# Altium schematic sheet Wenzel_REF.schdoc: =SheetTitle_Top
size 420 x 297 mm; EDA_Number: ARTIQ; Author: G.Kasprowicz; CompanyName: WUT ISE; DrawnBy: G.Kasprowicz; Organization: WUT ISE; Address1: PW ISE; Address2: Nowowiejska 15/19 00-665 Warsaw; Address3: gkasprow@gmail.com; ModifiedBy: -; CheckedDate: -; Title2: Top; DivGrp: WUT ISE; Designer: G.Kasprowicz; ModifiedDate: -; ProjectName: Sensor Box
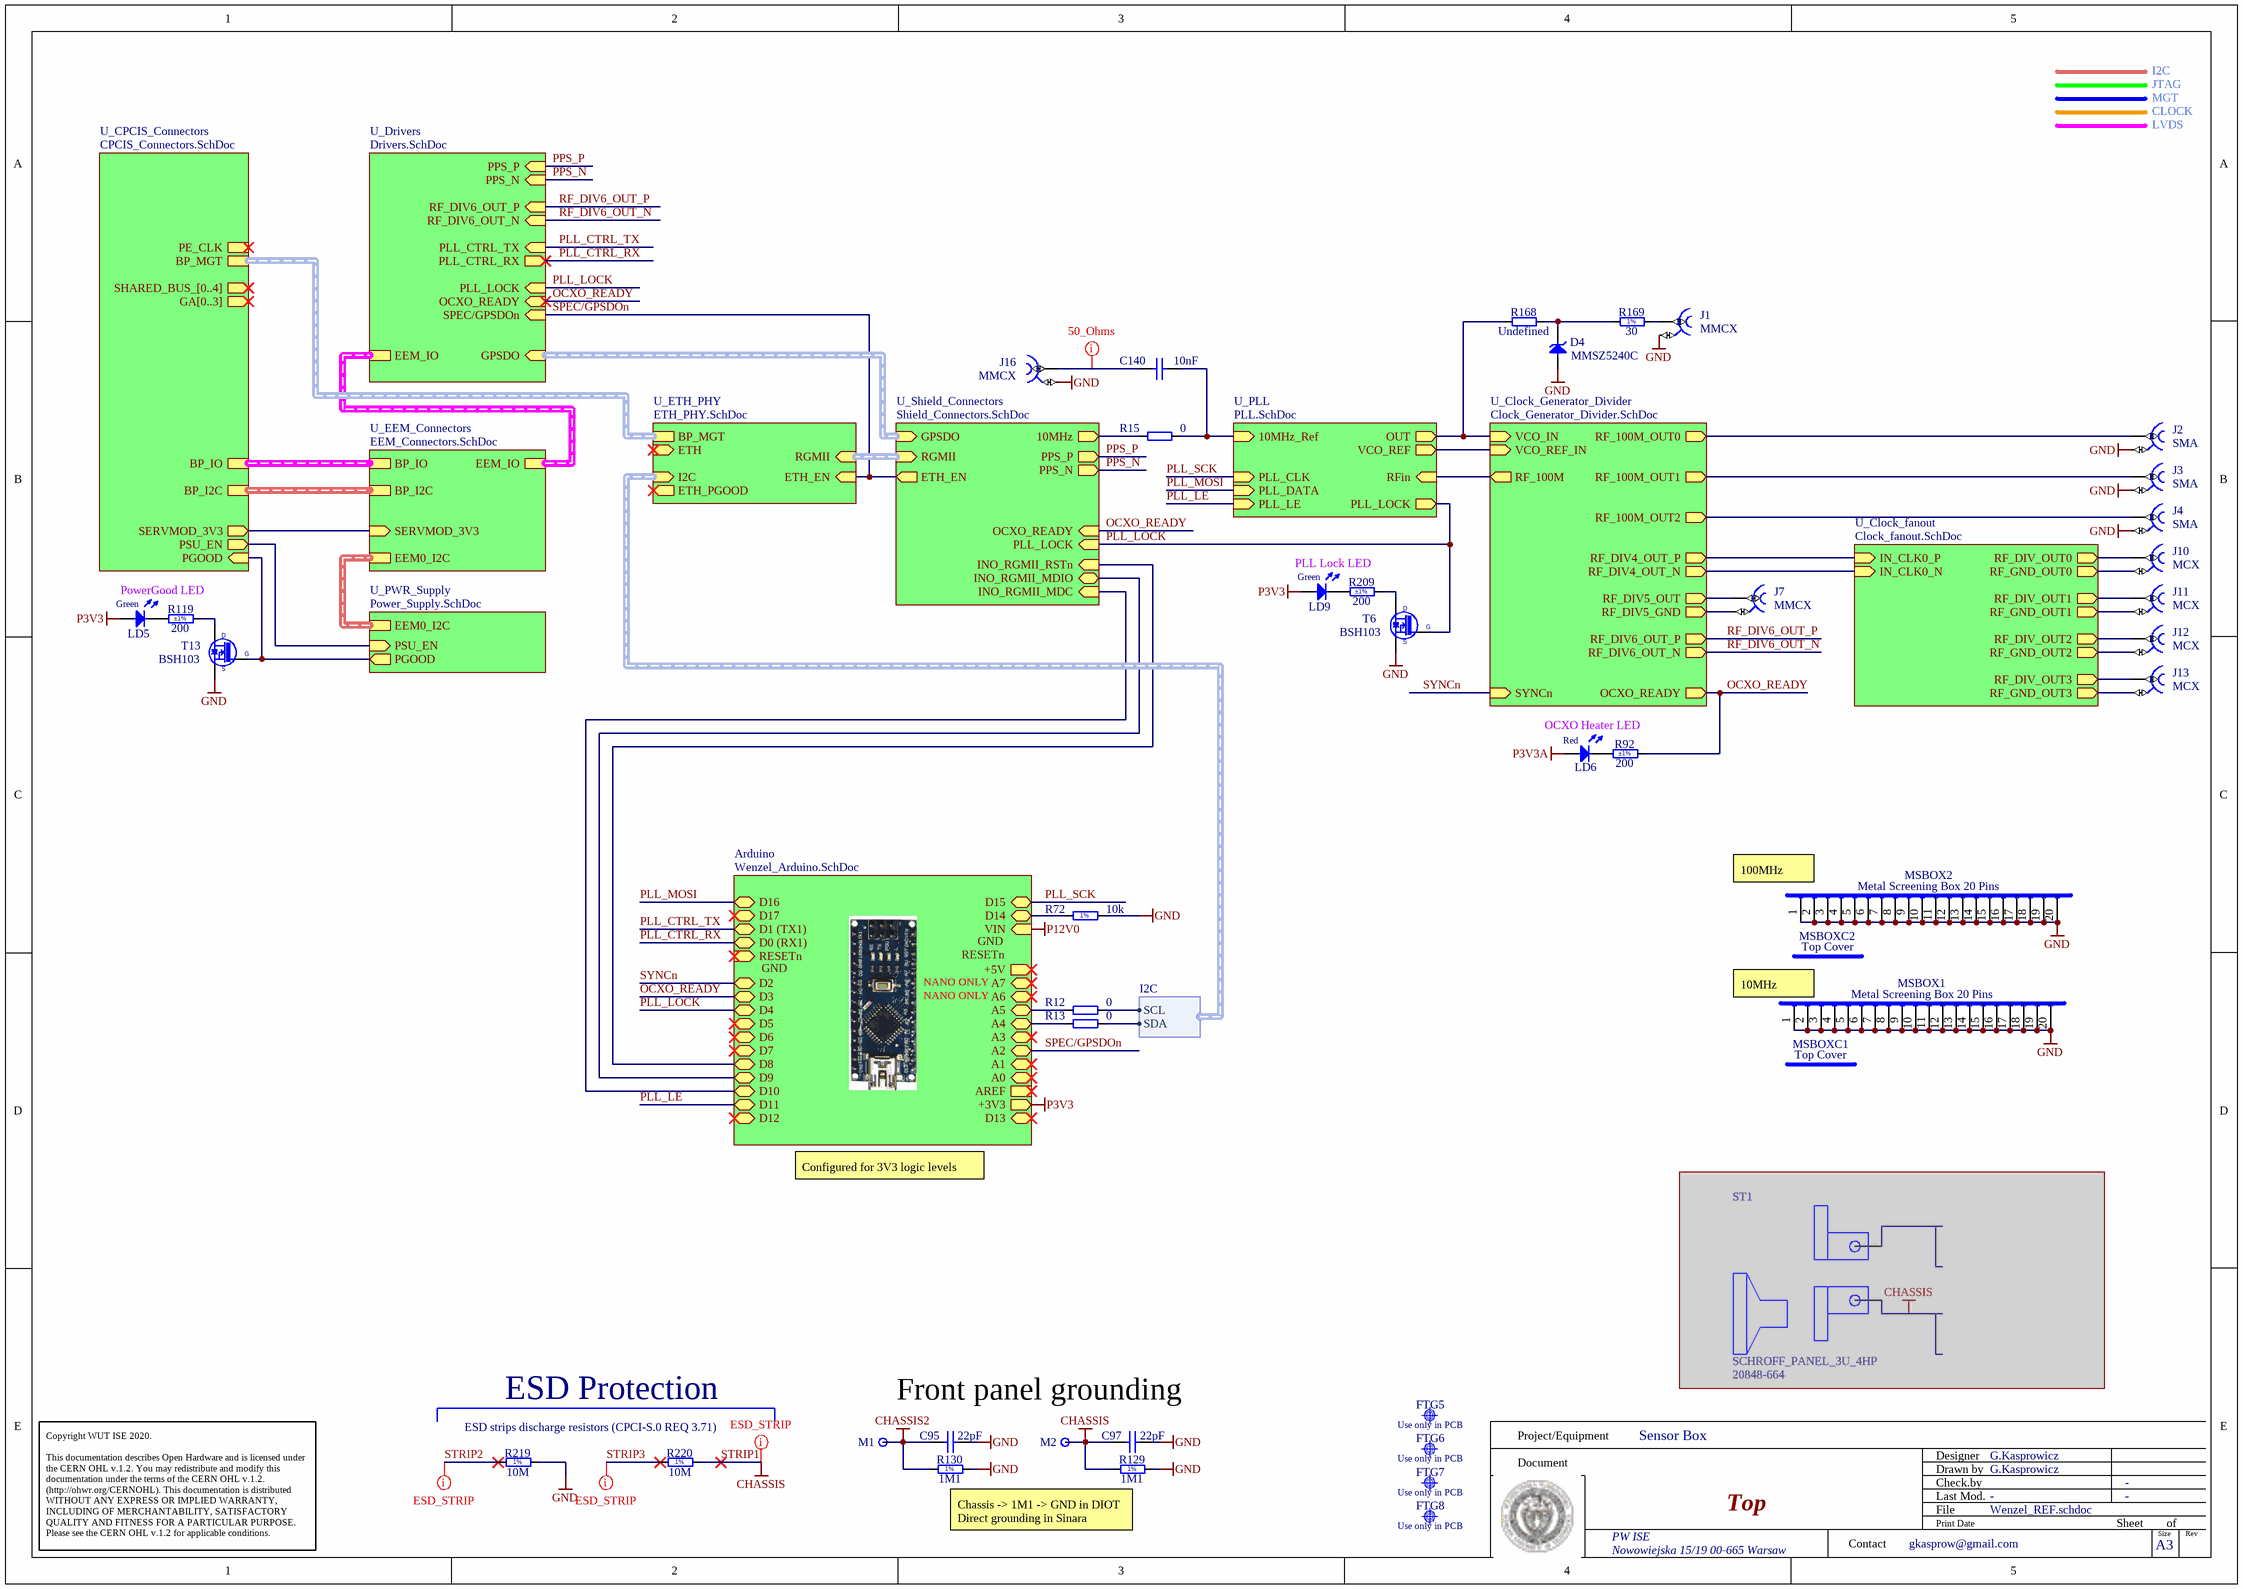
[diagram p0: Wenzel_REF.schdoc]

## Parts
C95  22pF  [CAPC1005X55N]
C97  22pF  [CAPC1005X55N]
C140  10nF  [CAPC1005X55N]
D4  MMSZ5240C  [SOD3716X135N]
FTG5  Use only in PCB  [FIDUCIAL_TOP_C100-200]  (no BOM)
FTG6  Use only in PCB  [FIDUCIAL_TOP_S100-200]  (no BOM)
FTG7  Use only in PCB  [FIDUCIAL_TOP_S100-200]  (no BOM)
FTG8  Use only in PCB  [FIDUCIAL_TOP_S100-200]  (no BOM)
J1  MMCX  [SAMTEC_MMCX-J-P-H-ST-TH1]
J2  SMA  [MOLEX_73251-2120]
J3  SMA  [MOLEX_73251-2120]
J4  SMA  [MOLEX_73251-2120]
J7  MMCX  [SAMTEC_MMCX-J-P-H-ST-TH1]
J10  MCX  [AMPHENOL_919-383J-51A]
J11  MCX  [AMPHENOL_919-383J-51A]
J12  MCX  [AMPHENOL_919-383J-51A]
J13  MCX  [AMPHENOL_919-383J-51A]
J16  MMCX  [SAMTEC_MMCX-J-P-H-ST-TH1]
LD5  Green  [LED_DIALIGHT_555-230]
LD6  Red  [LED_DIALIGHT_555-200]
LD9  Green  [LED_DIALIGHT_555-230]
M1  Plated Hole  [MTG300_600]  (value not drawn)  (no BOM)
M2  Plated Hole  [MTG300_600]  (value not drawn)  (no BOM)
MSBOX1  Metal Screening Box 20 Pins  [MSBOX_LAIRD_BMI-S-204-F]
MSBOX2  Metal Screening Box 20 Pins  [MSBOX_LAIRD_BMI-S-204-F]
MSBOXC1  Top Cover  [MSBOX_LAIRD_BMI-S-204-C]
MSBOXC2  Top Cover  [MSBOX_LAIRD_BMI-S-204-C]
R12  0  [RESC1005X40N]
R13  0  [RESC1005X40N]
R15  0  [RESC1005X40N]
R72  10k  [RESC1005X40N]
R92  200  Tolerance: ±1%  [RESC1005X40N]
R119  200  Tolerance: ±1%  [RESC1005X40N]
R129  1M1  [RESC2012X60N]
R130  1M1  [RESC2012X60N]
R168  Undefined  [RESC1608X55N]
R169  30  [RESC1608X55N]
R209  200  Tolerance: ±1%  [RESC1005X40N]
R219  10M  [RESC2113X55N]
R220  10M  [RESC2113X55N]
ST1  SCHROFF_PANEL_3U_4HP  Manufacturer Part Number 2: 20848-664  [SCHROFF_PANEL_3HP_4U]  (masked out: inside a compile mask, not in the netlist)
T6  BSH103  [SOT95P230X110-3N]
T13  BSH103  [SOT95P230X110-3N]

## Sub-sheets
Arduino = Wenzel_Arduino.SchDoc: D16 (bidir), D2 (bidir), D3 (bidir), D1 (TX1) (bidir), D17 (bidir), D7 (bidir), D8 (bidir), D9 (bidir), D14 (bidir), D11 (bidir), D0 (RX1) (bidir), D10 (bidir), D6 (bidir), D15 (bidir), D4 (bidir), D5 (bidir), D12 (bidir), A7 (bidir), D13 (bidir), +3V3 (out), +5V (out), AREF, A1 (bidir), A3 (bidir), A4 (bidir), A2 (bidir), VIN (in), RESETn (in), A6 (bidir), A5 (bidir), A0 (bidir)
U_Clock_fanout = Clock_fanout.SchDoc: IN_CLK0_P (in), IN_CLK0_N (in), RF_DIV_OUT0 (out), RF_GND_OUT0 (out), RF_DIV_OUT1 (out), RF_DIV_OUT2 (out), RF_DIV_OUT3 (out), RF_GND_OUT1 (out), RF_GND_OUT2 (out), RF_GND_OUT3 (out)
U_Clock_Generator_Divider = Clock_Generator_Divider.SchDoc: RF_100M_OUT0 (out), RF_100M_OUT1 (out), RF_100M_OUT2 (out), SYNCn (in), VCO_IN (in), VCO_REF_IN (in), OCXO_READY (out), RF_DIV4_OUT_P (out), RF_DIV4_OUT_N (out), RF_DIV5_OUT (out), RF_DIV5_GND (out), RF_DIV6_OUT_P (out), RF_DIV6_OUT_N (out), RF_100M (out)
U_CPCIS_Connectors = CPCIS_Connectors.SchDoc: BP_I2C (harness I2C), SERVMOD_3V3 (out), PSU_EN (out), PE_CLK (harness CLK_DIFF), BP_MGT (harness MGT), GA[0..3] (out), BP_IO (harness EEM_LVDS), SHARED_BUS_[0..4] (out), PGOOD (in)
U_Drivers = Drivers.SchDoc: OCXO_READY (in), RF_DIV6_OUT_P (in), RF_DIV6_OUT_N (in), EEM_IO (harness EEM_LVDS), GPSDO (in, harness GPSDO), SPEC/GPSDOn (in), PLL_LOCK (in), PLL_CTRL_TX (in), PLL_CTRL_RX (out), PPS_P (in), PPS_N (in)
U_EEM_Connectors = EEM_Connectors.SchDoc: EEM_IO (harness EEM_LVDS), BP_IO (harness EEM_LVDS), EEM0_I2C (harness I2C), BP_I2C (harness I2C), SERVMOD_3V3 (in)
U_ETH_PHY = ETH_PHY.SchDoc: ETH_EN (in), ETH_PGOOD (out), RGMII (in, harness RGMII), I2C (in, harness I2C), ETH (in, harness SERDES), BP_MGT (harness MGT)
U_PLL = PLL.SchDoc: OUT (out), VCO_REF (out), 10MHz_Ref (in), RFin (in), PLL_CLK (in), PLL_LOCK (out), PLL_DATA (in), PLL_LE (in)
U_PWR_Supply = Power_Supply.SchDoc: PSU_EN (in), EEM0_I2C (harness I2C), PGOOD (out)
U_Shield_Connectors = Shield_Connectors.SchDoc: RGMII (in, harness RGMII), ETH_EN (out), 10MHz (out), PPS_P (out), GPSDO (in, harness GPSDO), PLL_LOCK (in), OCXO_READY (in), INO_RGMII_RSTn (in), INO_RGMII_MDIO (bidir), INO_RGMII_MDC (in), PPS_N (out)

## Harnesses
I2C: SCL, SDA

## Nets
CHASSIS2: C95.1 M1.1 R130.1
GND: C95.2 C97.2 D4.2(A) J1.2 J2.2 J3.2 J4.2 J16.2 MSBOX1.1 MSBOX1.2 MSBOX1.3 MSBOX1.4 MSBOX1.5 MSBOX1.6 MSBOX1.7 MSBOX1.8 MSBOX1.9 MSBOX1.10 MSBOX1.11 MSBOX1.12 MSBOX1.13 MSBOX1.14 MSBOX1.15 MSBOX1.16 MSBOX1.17 MSBOX1.18 MSBOX1.19 MSBOX1.20 MSBOX2.1 MSBOX2.2 MSBOX2.3 MSBOX2.4 MSBOX2.5 MSBOX2.6 MSBOX2.7 MSBOX2.8 MSBOX2.9 MSBOX2.10 MSBOX2.11 MSBOX2.12 MSBOX2.13 MSBOX2.14 MSBOX2.15 MSBOX2.16 MSBOX2.17 MSBOX2.18 MSBOX2.19 MSBOX2.20 R72.2 R129.2 R130.2 R219.2 T6.2(S) T13.2(S)
P3V3: LD5.2(A) LD9.2(A) ; sheet Arduino/+3V3
P3V3A: LD6.2(A)
P12V0: sheet Arduino/VIN
STRIP1: C97.1 M2.1 R129.1 R220.2  [also labelled CHASSIS]
OCXO_READY: R92.2 ; sheet U_Drivers/OCXO_READY, sheet U_Clock_Generator_Divider/OCXO_READY, sheet U_Shield_Connectors/OCXO_READY, sheet Arduino/D3
PLL_CTRL_RX: sheet U_Drivers/PLL_CTRL_RX, sheet Arduino/D0 (RX1)
PLL_CTRL_TX: sheet U_Drivers/PLL_CTRL_TX, sheet Arduino/D1 (TX1)
PLL_LE: sheet U_PLL/PLL_LE, sheet Arduino/D11
PLL_LOCK: T6.1(G) ; sheet U_Drivers/PLL_LOCK, sheet U_Shield_Connectors/PLL_LOCK, sheet U_PLL/PLL_LOCK, sheet Arduino/D4
PLL_MOSI: sheet U_PLL/PLL_DATA, sheet Arduino/D16
PLL_SCK: sheet U_PLL/PLL_CLK, sheet Arduino/D15
PPS_N: sheet U_Drivers/PPS_N, sheet U_Shield_Connectors/PPS_N
PPS_P: sheet U_Drivers/PPS_P, sheet U_Shield_Connectors/PPS_P
RF_DIV6_OUT_N: sheet U_Drivers/RF_DIV6_OUT_N, sheet U_Clock_Generator_Divider/RF_DIV6_OUT_N
RF_DIV6_OUT_P: sheet U_Drivers/RF_DIV6_OUT_P, sheet U_Clock_Generator_Divider/RF_DIV6_OUT_P
SPEC/GPSDOn: sheet U_Drivers/SPEC/GPSDOn, sheet U_Shield_Connectors/ETH_EN, sheet U_ETH_PHY/ETH_EN, sheet Arduino/A2
STRIP2: R219.1
STRIP3: R220.1
SYNCn: sheet U_Clock_Generator_Divider/SYNCn, sheet Arduino/D2
NetC140_1: C140.1 R15.1 ; sheet U_PLL/10MHz_Ref
NetC140_2: C140.2 J16.1
NetD4_1: D4.1(C) R168.2 R169.1
NetJ1_1: J1.1 R169.2
NetJ2_1: J2.1 ; sheet U_Clock_Generator_Divider/RF_100M_OUT0
NetJ3_1: J3.1 ; sheet U_Clock_Generator_Divider/RF_100M_OUT1
NetJ4_1: J4.1 ; sheet U_Clock_Generator_Divider/RF_100M_OUT2
NetJ7_1: J7.1 ; sheet U_Clock_Generator_Divider/RF_DIV5_OUT
NetJ7_2: J7.2 ; sheet U_Clock_Generator_Divider/RF_DIV5_GND
NetJ10_1: J10.1 ; sheet U_Clock_fanout/RF_DIV_OUT0
NetJ10_2: J10.2 ; sheet U_Clock_fanout/RF_GND_OUT0
NetJ11_1: J11.1 ; sheet U_Clock_fanout/RF_DIV_OUT1
NetJ11_2: J11.2 ; sheet U_Clock_fanout/RF_GND_OUT1
NetJ12_1: J12.1 ; sheet U_Clock_fanout/RF_DIV_OUT2
NetJ12_2: J12.2 ; sheet U_Clock_fanout/RF_GND_OUT2
NetJ13_1: J13.1 ; sheet U_Clock_fanout/RF_DIV_OUT3
NetJ13_2: J13.2 ; sheet U_Clock_fanout/RF_GND_OUT3
NetLD5_1: LD5.1(C) R119.1
NetLD6_1: LD6.1(C) R92.1
NetLD9_1: LD9.1(C) R209.1
NetR12_1: R12.1 ; sheet U_ETH_PHY/I2C.SCL
NetR12_2: R12.2 ; sheet Arduino/A5
NetR13_1: R13.1 ; sheet U_ETH_PHY/I2C.SDA
NetR13_2: R13.2 ; sheet Arduino/A4
NetR15_2: R15.2 ; sheet U_Shield_Connectors/10MHz
NetR72_1: R72.1 ; sheet Arduino/D14
NetR119_2: R119.2 T13.3(D)
NetR168_1: R168.1 ; sheet U_Clock_Generator_Divider/VCO_IN, sheet U_PLL/OUT
NetR209_2: R209.2 T6.3(D)
NetT13_1: T13.1(G) ; sheet U_PWR_Supply/PGOOD, sheet U_CPCIS_Connectors/PGOOD
(unnamed): sheet U_Clock_fanout/IN_CLK0_P, sheet U_Clock_Generator_Divider/RF_DIV4_OUT_P
(unnamed): sheet U_Clock_fanout/IN_CLK0_N, sheet U_Clock_Generator_Divider/RF_DIV4_OUT_N
(unnamed): sheet U_Clock_Generator_Divider/VCO_REF_IN, sheet U_PLL/VCO_REF
(unnamed): sheet U_Clock_Generator_Divider/RF_100M, sheet U_PLL/RFin
(unnamed): sheet U_Shield_Connectors/INO_RGMII_RSTn, sheet Arduino/D8
(unnamed): sheet U_Shield_Connectors/INO_RGMII_MDIO, sheet Arduino/D9
(unnamed): sheet U_Shield_Connectors/INO_RGMII_MDC, sheet Arduino/D10
(unnamed): sheet U_PWR_Supply/PSU_EN, sheet U_CPCIS_Connectors/PSU_EN
(unnamed): sheet U_CPCIS_Connectors/SERVMOD_3V3, sheet U_EEM_Connectors/SERVMOD_3V3

## Buses and harness runs
harness sheet U_CPCIS_Connectors/BP_I2C = sheet U_EEM_Connectors/BP_I2C
harness sheet U_CPCIS_Connectors/BP_IO = sheet U_EEM_Connectors/BP_IO
harness sheet U_CPCIS_Connectors/BP_MGT = sheet U_ETH_PHY/BP_MGT
harness sheet U_Drivers/EEM_IO = sheet U_EEM_Connectors/EEM_IO
harness sheet U_Drivers/GPSDO = sheet U_Shield_Connectors/GPSDO
harness sheet U_EEM_Connectors/EEM0_I2C = sheet U_PWR_Supply/EEM0_I2C
harness sheet U_ETH_PHY/RGMII = sheet U_Shield_Connectors/RGMII

## Layout directives
net class ESD_STRIP: STRIP1, STRIP2, STRIP3
net class 50_Ohms: NetC140_2

## Notes on the sheet
- I2C
- JTAG
- MGT
- CLOCK
- LVDS
- PowerGood LED
- PLL Lock LED
- OCXO Heater LED
- (near MSBOX2) 100MHz
- GND
- NANO ONLY
- RESETn
- 10MHz
- Configured for 3V3 logic levels
- ESD Protection
- Front panel grounding
- ESD strips discharge resistors (CPCI-S.0 REQ 3.71)
- Chassis -> 1M1 -> GND in DIOT
  Direct grounding in Sinara
- Project/Equipment
- Document
- Designer
- Drawn by
- Check.by
- Copyright WUT ISE 2020.
  This documentation describes Open Hardware and is licensed under the CERN OHL v.1.2. You may redistribute and modify this documentation under the terms of the CERN OHL v.1.2. (http://ohwr.org/CERNOHL). This documentation is distributed WITHOUT ANY EXPRESS OR IMPLIED WARRANTY, INCLUDING OF MERCHANTABILITY, SATISFACTORY QUALITY AND FITNESS FOR A PARTICULAR PURPOSE. Please see the CERN OHL v.1.2 for applicable conditions.
- Contact
- File
- Last Mod.
- Print Date
- Sheet
- Size
- A3
- of
- Rev
- (in symbol R0402_10K_1%_0.0625W_100PPM) 1%
- (in symbol R0603_30R_1%_0.1W_100PPM) 1%
- (in symbol R0805_1M1_1%_0.125W_100PPM) 1%
- (in symbol R0805_10M_1%_0.125W_100PPM_VISHAY_CRCW e3) 1%

## Library data of the parts
C95 C97 = CC0402_22PF_50V_5%_C0G: Non-polarised capacitor; Part Description: SMD Multilayer Chip Ceramic Capacitor; Manufacturer: GENERIC; Manufacturer1 Part Number: C0402C220J5GACTU; Voltage: 50V; TC: C0G/NP0; Tolerance: ±5%; Part Number: CC0402_22PF_50V_5%_C0G; Component Kind: Standard; Component Type: Standard; Pin Count: 2; Value: 22pF; Status: Preferred; Manufacturer Part Number: CC0402_22PF_50V_5%_C0G; Case: 0402; Mounted: Yes; Socket: No; SMD: Yes; Manufacturer1 Example: KEMET; Manufacturer1 ComponentHeight: 0.55mm; HelpURL: \\cern.ch\dfs\Applications\Altium\Datasheets\CC0402_C0G_KEMET_(Commercial Grade).pdf; Author: CERN DEM JLC; CreateDate: 2007-12-03; LatestRevisionDate: 2007-12-03; Sense: No
C140 = CC0402_10NF_16V_10%_X7R: Non-polarised capacitor; Part Description: SMD Multilayer Chip Ceramic Capacitor; Manufacturer: GENERIC; Manufacturer1 Part Number: 223878715636; Voltage: 16V; TC: X7R; Tolerance: ±10%; Part Number: CC0402_10NF_16V_10%_X7R; Component Kind: Standard; Component Type: Standard; Pin Count: 2; Value: 10nF; Status: Not Recommended; Manufacturer Part Number: CC0402_10NF_16V_10%_X7R; Case: 0402; Mounted: Yes; Socket: No; SMD: Yes; Sense: No; Manufacturer1 Example: PHYCOMP; Manufacturer1 ComponentHeight: 0.55mm; HelpURL: \\cern.ch\dfs\Applications\Altium\Datasheets\CC0402_X7R_PHYCOMP.pdf; Author: CERN DEM JLC; CreateDate: 2007-12-03; LatestRevisionDate: 2007-12-03
D4 = MMSZ5240C: Zener Diode; Part Description: Small Signal Zener Diode; Manufacturer: VISHAY SEMICONDUCTORS; Voltage: 10V; Power: 500mW; PressFit: No; Bonding: No; Part Number: MMSZ5240C; Component Kind: Standard; Component Type: Standard; Device: MMSZ5240C; PackageDescription: Diode (SOD-123), 2.70mm W X 1.60mm L X 1.35mm H body, IPC Medium Density; Manufacturer Part Number: MMSZ5240C; Pin Count: 2; Case: SOD-123; Mounted: Yes; Socket: No; SMD: Yes; Sense: No; ComponentHeight: 1.35mm; HelpURL: \\cern.ch\dfs\Applications\Altium\Datasheets\MMSZ5248B-E3-08.pdf; Author: CERN DEM HF; CreateDate: 23.05.2022; LatestRevisionDate: 23.05.2022
FTG5 = FIDUCIAL_TARGET_C100-200: Fiducial Target; Part Description: Round Fiducial Target, Top Layer, 1.0mm, Top Solder 2.0mm, Keepout =2.0mm; Mounted: No; Part Number: FIDUCIAL_TARGET_C100-200; Component Type: Standard (No BOM); Pin Count: 1; Family: Fiducial; Socket: No; SMD: Yes; Sense: No; Status: None; ComponentHeight: 0mm; HelpURL: Undefined; Author: CERN DEM JLC; CreateDate: 09.02.2010; LatestRevisionDate: 04.04.2012; PackageDescription: Round Fiducial Target, Top Layer, 1.0mm, Top Solder 2.0mm, Keepout =2.0mm
FTG6-FTG8 = FIDUCIAL_TARGET_S100-200: Fiducial Target; Part Description: Square Fiducial Target, Top Layer, 1.0mm, Top Solder 2.0mm, Keepout =2.0mm; Mounted: No; Part Number: FIDUCIAL_TARGET_S100-200; Component Type: Standard (No BOM); Pin Count: 1; Family: Fiducial; Socket: No; SMD: Yes; Sense: No; Status: None; ComponentHeight: 0mm; HelpURL: Undefined; Author: CERN DEM JLC; CreateDate: 09.02.2010; LatestRevisionDate: 04.04.2012; PackageDescription: Square Fiducial Target, Top Layer, 1.0mm, Top Solder 2.0mm, Keepout =2.0mm
J1 J7 J16 = SAMTEC_MMCX-J-P-H-ST-TH1: Part Description: Straight Through-hole 50 Ohms Micro Mini RF Jack, MMCX Series; Manufacturer: SAMTEC; PressFit: No; Part Number: SAMTEC_MMCX-J-P-H-ST-TH1; Component Kind: Standard; Component Type: Standard; Pin Count: 2; Mounted: Yes; Socket: No; SMD: No; Sense: No; Status: None; Manufacturer Part Number: MMCX-J-P-H-ST-TH1; ComponentHeight: 4.35mm; HelpURL: \\cern.ch\dfs\Applications\Altium\Datasheets\SAMTEC_MMCX-J-P-H-ST-TH1.pdf; Author: CERN DEM JLC; CreateDate: 05.12.2012; LatestRevisionDate: 05.12.2012
J2-J4 = CON_SMA_RA_SMD_73251-2120: 50 Ohm, SMA Edge Mount PCB, With Jam Nut And Lock Washer; Manufacturer: MOLEX; PressFit: No; Part Number: MOLEX_73251-2120; Component Kind: Standard; Component Type: Standard; Pin Count: 5; Family: SMA; Mounted: Yes; Socket: No; SMD: Yes; Sense: No; Status: None; Part Description: 50 Ohm, SMA Edge Mount PCB, With Jam Nut And Lock Washer; Manufacturer Part Number: 73251-2120; ComponentHeight: 5.75mm; HelpURL: \\cern.ch\dfs\Applications\Altium\Datasheets\MOLEX_73251-2121.pdf; Author: CERN DEM JLC; CreateDate: 26.10.2016; LatestRevisionDate: 26.10.2016
J10-J13 = AMPHENOL_919-383J-51A: Part Description: 50 Ohm, RF Connector, MCX Right Angle PCB Receptacle Jack; PressFit: No; Part Number: AMPHENOL_919-383J-51A; Component Kind: Standard; Component Type: Standard; Pin Count: 5; Family: MCX; Mounted: Yes; Socket: No; SMD: No; Sense: No; Status: None; Manufacturer: AMPHENOL; Manufacturer Part Number: 919-383J-51A; ComponentHeight: 6mm; HelpURL: \\cern.ch\dfs\Applications\Altium\Datasheets\AMPHENOL_919-383J-51A.pdf; Author: CERN DEM BC; CreateDate: 31.01.2019; LatestRevisionDate: 31.01.2019
LD5 LD9 = LED_DIALIGHT_555-2301F: LED Green 1C 2A; Part Description: Single 2mm Green LED CBI® Circuit Board Indicator; PressFit: No; Bonding: No; Part Number: LED_DIALIGHT_555-2301F; Component Kind: Standard; Component Type: Standard; Color: Green; PackageDescription: Single 2mm Green LED, Body 5.08x2.54mm, Pin spacing 2.54mm; Manufacturer: DIALIGHT; Manufacturer Part Number: 555-2301F; Pin Count: 2; Mounted: Yes; Socket: No; SMD: No; Sense: No; ComponentHeight: 6.35mm; HelpURL: \\cern.ch\dfs\Applications\Altium\Datasheets\LED_DIALIGHT_555-2301F.pdf; Author: CERN DEM JMW; CreateDate: 22.09.2008; LatestRevisionDate: 17.03.2010
LD6 = LED_DIALIGHT_555-2001F: LED Red 1C 2A; Part Description: Single 2mm Red LED CBI® Circuit Board Indicator; PressFit: No; Bonding: No; Part Number: LED_DIALIGHT_555-2001F; Component Kind: Standard; Component Type: Standard; Color: Red; PackageDescription: Single 2mm Red LED, Body 5.08x2.54mm, Pin spacing 2.54mm; Manufacturer: DIALIGHT; Manufacturer Part Number: 555-2001F; Pin Count: 2; Mounted: Yes; Socket: No; SMD: No; Sense: No; ComponentHeight: 6.35mm; HelpURL: \\cern.ch\dfs\Applications\Altium\Datasheets\LED_DIALIGHT_555-2001F.pdf; Author: CERN DEM JMW; CreateDate: 22.09.2008; LatestRevisionDate: 17.03.2010
M1 M2 = PLATED_HOLE3.0_PAD6.0: Single Terminal Socket; Part Description: Plated Through Hole: Hole Dia.=3.0mm Pad Dia.=6.0mm; Mounted: No; Table: Pads; Part Number: PLATED_HOLE3.0_PAD6.0; Component Type: Standard (No BOM); Designator: Single Terminal Socket; Library Reference: Single Terminal Socket; Pin Count: 1; Family: Plated Hole; Socket: No; SMD: No; Status: None; ComponentHeight: 0mm; Author: CERN DEM JLC; CreateDate: 26.05.2008; LatestRevisionDate: 26.05.2008; PackageDescription: Plated Through Hole: Hole Dia.=3.0mm Pad Dia.=6.0mm
MSBOX1 MSBOX2 = MSBOX_LAIRD_BMI-S-204-F: Part Description: Frame of Standard Surface Mount Shield (Two Piece), External Dimensions 32 x 32mm; Manufacturer: LAIRD; PressFit: No; Part Number: MSBOX_LAIRD_BMI-S-204-F; Component Kind: Standard; Component Type: Standard; Pin Count: 20; PackageDescription: Frame of Standard Surface Mount Shield (Two Piece), External Dimensions 32 x 32mm; Mounted: Yes; Socket: No; SMD: Yes; Sense: No; Status: None; Manufacturer Part Number: BMI-S-204-F; ComponentHeight: 6mm; HelpURL: \\cern.ch\dfs\Applications\Altium\Datasheets\MSBOX_LAIRD_BMI-S-205-F.pdf; Author: CERN DEM JLC; CreateDate: 21.06.2017; LatestRevisionDate: 21.06.2017
MSBOXC1 MSBOXC2 = MSBOX_LAIRD_BMI-S-204-C: Metal Screening Box - Top Cover 0 Pin; Part Description: Cover for Frame of Standard Surface Mount Shield (Two Piece), External Dimensions 32.46 x 32.46mm; Manufacturer: LAIRD; PressFit: No; Part Number: MSBOX_LAIRD_BMI-S-204-C; Component Kind: Accessories; Component Type: Standard; Pin Count: 0; PackageDescription: Cover for Frame of Standard Surface Mount Shield (Two Piece), External Dimensions 32.46 x 32.46mm; Mounted: Yes; Socket: No; SMD: Yes; Sense: No; Status: None; Manufacturer Part Number: BMI-S-204-C; ComponentHeight: 2mm; HelpURL: \\cern.ch\dfs\Applications\Altium\Datasheets\MSBOX_LAIRD_BMI-S-205-C.pdf; Author: CERN DEM JLC; CreateDate: 21.06.2017; LatestRevisionDate: 21.06.2017
R12 R13 R15 = R0402_0R_JUMPER: Resistor; Part Description: 1A (0.05R Max DC Resistance) Zero Ohm Jumper; Manufacturer: GENERIC; Manufacturer1 Part Number: 232270591001L; Part Number: R0402_0R_JUMPER; Component Kind: Standard; Component Type: Standard; Pin Count: 2; Value: 0; Status: Not recommended; Manufacturer Part Number: R0402_0R_JUMPER; Case: 0402; Mounted: Yes; Sense: No; Socket: No; SMD: Yes; Manufacturer1 Example: YAGEO PHYCOMP; Manufacturer1 ComponentHeight: 0.4mm; HelpURL: \\cern.ch\dfs\Applications\Altium\Datasheets\R0402_Phycomp_RC0402.pdf; Author: CERN DEM JLC; CreateDate: 03.12.2007; LatestRevisionDate: 17.10.2012
R72 = R0402_10K_1%_0.0625W_100PPM: Resistor - 1%; Part Description: General Purpose Thick Film Chip Resistor; Manufacturer: GENERIC; Manufacturer1 Part Number: 232270671003L; TC: ±100ppm/°C; PressFit: No; Part Number: R0402_10K_1%_0.0625W_100PPM; Component Kind: Standard; Component Type: Standard; Pin Count: 2; Value: 10k; Status: Not Recommended; Power: 0.0625W; Tolerance: ±1%; Manufacturer Part Number: R0402_10K_1%_0.0625W_100PPM; Case: 0402; Mounted: Yes; Sense: No; Socket: No; SMD: Yes; Manufacturer1 Example: YAGEO PHYCOMP; Manufacturer1 ComponentHeight: 0.4mm; HelpURL: \\cern.ch\dfs\Applications\Altium\Datasheets\R0402_Phycomp_RC0402.pdf; Author: CERN DEM JLC; CreateDate: 03.12.2007; LatestRevisionDate: 17.10.2012
R92 R119 R209 = R0402_200R_1%_0.0625W_100PPM: Resistor - 1%; Part Description: General Purpose Thick Film Chip Resistor; Manufacturer: GENERIC; Manufacturer1 Part Number: 232270672001L; TC: ±100ppm/°C; PressFit: No; Part Number: R0402_200R_1%_0.0625W_100PPM; Component Kind: Standard; Component Type: Standard; Pin Count: 2; Value: 200; Status: Not Recommended; Power: 0.0625W; Manufacturer Part Number: R0402_200R_1%_0.0625W_100PPM; Case: 0402; Mounted: Yes; Sense: No; Socket: No; SMD: Yes; Manufacturer1 Example: YAGEO PHYCOMP; Manufacturer1 ComponentHeight: 0.4mm; HelpURL: \\cern.ch\dfs\Applications\Altium\Datasheets\R0402_Phycomp_RC0402.pdf; Author: CERN DEM JLC; CreateDate: 03.12.2007; LatestRevisionDate: 17.10.2012
R129 R130 = R0805_1M1_1%_0.125W_100PPM: Resistor - 1%; Part Description: General Purpose Thick Film Chip Resistor; Manufacturer: GENERIC; Manufacturer1 Part Number: NRC10F1104TRF; PressFit: No; Part Number: R0805_1M1_1%_0.125W_100PPM; Component Kind: Standard; Component Type: Standard; Pin Count: 2; Value: 1M1; Status: Preferred; Manufacturer Part Number: R0805_1M1_1%_0.125W_100PPM; Case: 0805; Mounted: Yes; Sense: No; Socket: No; SMD: Yes; Manufacturer1 Example: NIC COMPONENT; Manufacturer1 ComponentHeight: 0.6mm; HelpURL: \\cern.ch\dfs\Applications\Altium\Datasheets\R0805_NIC_NRC.pdf; Author: CERN DEM JLC; CreateDate: 03/12/2007; LatestRevisionDate: 13/03/2008
R168 = R0603_NO-VALUE: Resistor; Part Description: Reserved Footprint For a 0603 (1608) Chip Resistor; PressFit: No; Mounted: No; Part Number: R0603_NO-VALUE; Component Kind: Standard; Component Type: Standard; Pin Count: 2; Value: Undefined; Status: None; Manufacturer: Undefined; Manufacturer Part Number: R0603_NO-VALUE; Case: 0603; Sense: No; Socket: No; SMD: Yes; Manufacturer1 Example: Undefined; Manufacturer1 Part Number: Undefined; Manufacturer1 ComponentHeight: Undefined; HelpURL: Undefined; Author: CERN DEM JLC; CreateDate: 03.12.2007; LatestRevisionDate: 13.03.2008
R169 = R0603_30R_1%_0.1W_100PPM: Resistor - 1%; Part Description: General Purpose Thick Film Chip Resistor; Manufacturer: GENERIC; Manufacturer1 Part Number: NRC06F30R0TRF; Power: 0.1W; TC: ±100ppm/°C; PressFit: No; Part Number: R0603_30R_1%_0.1W_100PPM; Component Kind: Standard; Component Type: Standard; Pin Count: 2; Value: 30; Status: Preferred; Tolerance: ±1%; Manufacturer Part Number: R0603_30R_1%_0.1W_100PPM; Case: 0603; Mounted: Yes; Sense: No; Socket: No; SMD: Yes; Manufacturer1 Example: NIC COMPONENT; Manufacturer1 ComponentHeight: 0.55mm; HelpURL: \\cern.ch\dfs\Applications\Altium\Datasheets\R0603_NIC_NRC.pdf; Author: CERN DEM JLC; CreateDate: 03/12/2007; LatestRevisionDate: 13/03/2008
R219 R220 = R0805_10M_1%_0.125W_100PPM_VISHAY_CRCW e3: Resistor - 1%; Part Description: 150V, Standard Thick Film Chip Resistor; Manufacturer: VISHAY DALE; Manufacturer Part Number: CRCW080510M0FKEA; Power: 0.125W; TC: ±100ppm/°C; PressFit: No; Part Number: R0805_10M_1%_0.125W_100PPM_VISHAY_CRCW e3; Component Kind: Standard; Component Type: Standard; Pin Count: 2; Value: 10M; Status: None; Tolerance: ±1%; Case: 0805; Mounted: Yes; Sense: No; Socket: No; SMD: Yes; ComponentHeight: 0.5mm; HelpURL: \\cern.ch\dfs\Applications\Altium\Datasheets\R0805_VISHAY_CRCW e3.pdf; Author: CERN DEM BC; CreateDate: 2019-11-12; LatestRevisionDate: 2019-11-12
ST1 = SCHROFF_PANEL_3U_4HP: Schroff 3HP 4U EUROCARD Panel Kit; Manufacturer Part Number: 20818-017; Manufacturer: Schroff
T6 T13 = BSH103: N-CHANNEL MOSFET WITH DIODE; Part Description: 30V 850mA N-Channel Enhancement Mode Field-Effect Transistor; Manufacturer: NEXPERIA; PressFit: No; Bonding: No; Part Number: BSH103; Component Kind: Standard; Component Type: Standard; Device: BSH103; PackageDescription: SOT23, 0.95mm Pitch; 3 Pin, 1.30mm W X 2.90mm L X 1.10mm H body, IPC Medium Density; Manufacturer Part Number: BSH103; Pin Count: 3; Case: SOT23-3; Mounted: Yes; Socket: No; SMD: Yes; Sense: No; ComponentHeight: 1.1mm; HelpURL: \\cern.ch\dfs\Applications\Altium\Datasheets\BSH103.pdf; Author: CERN DEM JLC; CreateDate: 16.03.2010; LatestRevisionDate: 20.06.2017